# Altium project H19R1.PrjPcb (part 1 of 2)
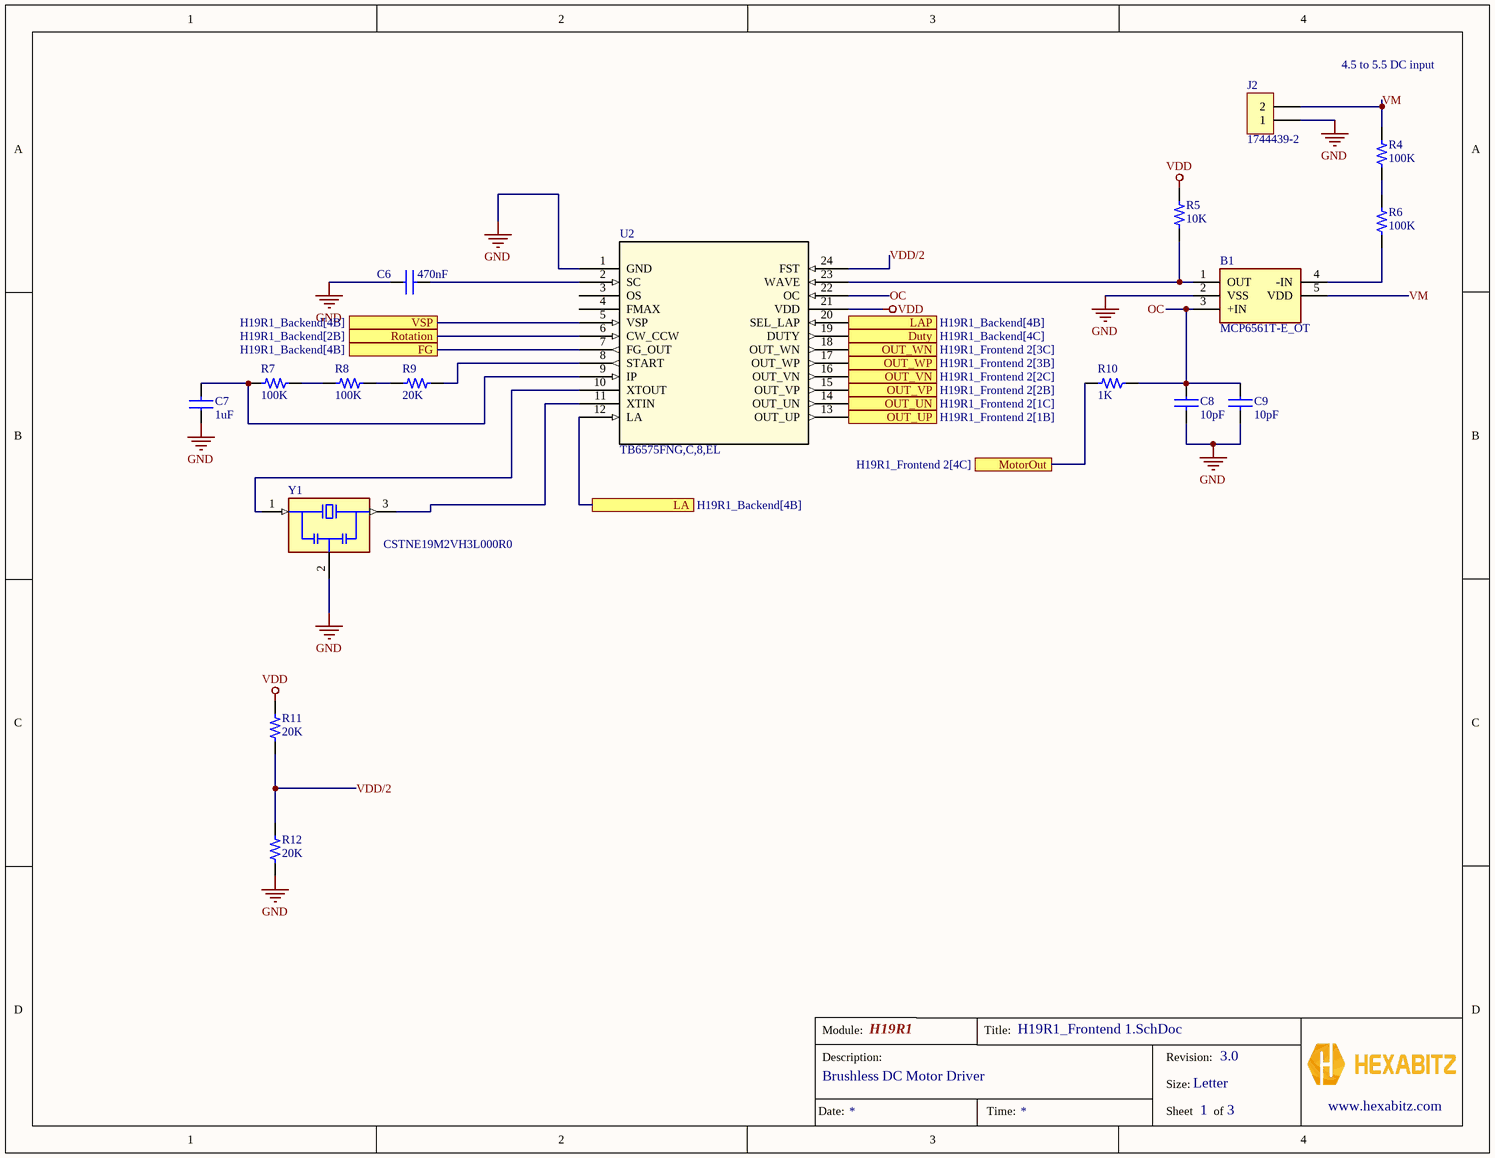
[diagram p0: H19R1_Frontend 1.SchDoc]
revision: 3.0; Module_Name: H19R1; Module_Description: Brushless DC Motor Driver
3 sheets, 80 parts. Net scope: flat (ports and power ports of the same name join across sheets).
Board file: H19R1.PcbDoc
Sheets:
  H19R1_Frontend 1.SchDoc
  H19R1_Frontend 2.SchDoc
  H19R1_Backend.SchDoc

## Sheet H19R1_Frontend 1.SchDoc
size Letter; CompanyName: Hexabitz; DocumentNumber: 1; SheetNumber: 1; SheetTotal: 3

### Parts
B1  MCP6561T-E_OT  [SOT95P270X145-5N]
C6  470nF  [C0402]
C7  value 1uF  [C0402]  (hidden comment: CL05A105KA5NQNC)
C8  value 10pF  [C0402]  (hidden comment: CC0402JRNPO9BN100)
C9  value 10pF  [C0402]  (hidden comment: CC0402JRNPO9BN100)
J2  1744439-2  [17444392]
R4  value 100K  [R0402_3]  (hidden comment: ERJ-2RKF1003X)
R5  value 10K  [R0402_3]  (hidden comment: RC0402FR-0710KL)
R6  value 100K  [R0402_3]  (hidden comment: ERJ-2RKF1003X)
R7  value 100K  [R0402_3]  (hidden comment: ERJ-2RKF1003X)
R8  value 100K  [R0402_3]  (hidden comment: ERJ-2RKF1003X)
R9  value 20K  [R0402_3]  (hidden comment: RMCF0402FT20K0)
R10  value 1K  [R0402_3]  (hidden comment: RC0402FR-071KL)
R11  value 20K  [R0402_3]  (hidden comment: RMCF0402FT20K0)
R12  value 20K  [R0402_3]  (hidden comment: RMCF0402FT20K0)
U2  TB6575FNG,C,8,EL  [SSOP24-P-300-0p65A_TOS]
Y1  CSTNE19M2VH3L000R0  [OSC_CSTNE19M2VH3L000R0]

### Ports
Duty (see H19R1_Backend[4C]), FG (see H19R1_Backend[4B]), LA (see H19R1_Backend[4B]), LAP (see H19R1_Backend[4B]), MotorOut (see H19R1_Frontend 2[4C]), OUT_UN (see H19R1_Frontend 2[1C]), OUT_UP (see H19R1_Frontend 2[1B]), OUT_VN (see H19R1_Frontend 2[2C]), OUT_VP (see H19R1_Frontend 2[2B]), OUT_WN (see H19R1_Frontend 2[3C]), OUT_WP (see H19R1_Frontend 2[3B]), Rotation (see H19R1_Backend[2B]), VSP (see H19R1_Backend[4B])

### Nets
GND: B1.2(VSS) C6.1 C7.1 C8.2 C9.2 J2.1 R12.2 U2.1(GND) Y1.2(GND)
VDD: R5.2 R11.1 U2.21(VDD)
Duty: U2.19(DUTY) ; port Duty
FG: U2.7(FG_OUT) ; port FG
LA: U2.12(LA) ; port LA
LAP: U2.20(SEL_LAP) ; port LAP
MotorOut: R10.1 ; port MotorOut
OC: B1.3(+IN) C8.1 C9.1 R10.2 U2.22(OC)
OUT_UN: U2.14(OUT_UN) ; port OUT_UN
OUT_UP: U2.13(OUT_UP) ; port OUT_UP
OUT_VN: U2.16(OUT_VN) ; port OUT_VN
OUT_VP: U2.15(OUT_VP) ; port OUT_VP
OUT_WN: U2.18(OUT_WN) ; port OUT_WN
OUT_WP: U2.17(OUT_WP) ; port OUT_WP
Rotation: U2.6(CW_CCW) ; port Rotation
VDD/2: R11.2 R12.1 U2.24(FST)
VM: B1.5(VDD) J2.2 R4.2
VSP: U2.5(VSP) ; port VSP
NetB1_1: B1.1(OUT) R5.1 U2.23(WAVE)
NetB1_4: B1.4(-IN) R6.1
NetC6_2: C6.2 U2.2(SC)
NetC7_2: C7.2 R7.1 U2.9(IP)
NetR4_1: R4.1 R6.2
NetR7_2: R7.2 R8.1
NetR8_2: R8.2 R9.2
NetR9_1: R9.1 U2.8(START)
NetU2_10: U2.10(XTOUT) Y1.1(IN)
NetU2_11: U2.11(XTIN) Y1.3(OUT)

Not connected (* = marked no-connect by the designer): U2 3(OS) 4(FMAX)

### Notes on the sheet
- 4.5 to 5.5 DC input
- Module:
- Title:
- Description:
- Size:
- Revision:
- Letter
- www.hexabitz.com
- Date:
- Time:
- Sheet
- of

### Library data of the parts
B1 = MCP6561T-E_OT: Single 1.8V Push/Pull Comparator, E temp; Manufacturer_Name: Microchip; Manufacturer_Part_Number: MCP6561T-E/OT; Geometry.Height: 1.45mm; Avnet Part Number: *; Avnet Price/Stock: *; Datasheet Link: https://datasheet.datasheetarchive.com/originals/distributors/Datasheets-DGA6/571611.pdf; Supplier 1: Newark; Supplier Part Number 1: MCP6561T-E/OT
C6 = C1005X7S1C474K050BC: Multilayer Ceramic Capacitor, 0.47 uF, 16 V, ± 10%, X7S, 0402 [1005 Metric]; Manufacturer: TDK; Material: 4241ConductorMaterial; Voltage Rating: 16V; Dielectric: 1542DielectricType; Library: Hexabitz; Supplier: Digikey; Supplier Part Number: 445-174768-1-ND; Manufacturer Part Number: C1005X7S1C474K050BC; RoHS: Yes; Category: Ceramic Capacitors; Stock: 28339; Pricing: 1=0.2, 10=0.117, 100=0.0734, 1000=0.05087, 2500=0.0442, 5000=0.04189 (USD); Mounting Technology: Surface Mount; Case/Package: 0402; Case Code (Imperial): 0402; Case Code (Metric): 1005; Min Operating Temperature: -55°C; Max Operating Temperature: 125°C; Packaging: Cut Tape; Tolerance: 10%; Series: C; Voltage Rating (DC): 16V; Length: 1mm; Width: 500um; Height: 550um; Thickness: 500um; RoHS Compliant: Yes; Lead Free: 5697LeadFree; ComponentLink1URL: https://product.tdk.com/info/en/catalog/spec/mlccspec_commercial_general_midvoltage_en.pdf?src-supplier=Digikey; ComponentLink1Description: https://product.tdk.com/info/en/catalog/spec/mlccspec_commercial_general_midvoltage_en.pdf?src-supplier=Digikey; ComponentLink2URL: https://product.tdk.com/info/en/catalog/datasheets/mlcc_commercial_general_en.pdf?src-supplier=Digikey; ComponentLink2Description: https://product.tdk.com/info/en/catalog/datasheets/mlcc_commercial_general_en.pdf?src-supplier=Digikey; Supplier 1: Digikey; Supplier Part Number 1: 445-174768-6-ND; Value: 470nF
C7 = CL05A105KA5NQNC: Multilayer Ceramic Capacitor, 1 Uf, 25 V, ½ 10%, X5R, 0402 [1005 Metric]; Manufacturer: Samsung; Voltage Rating: 25V; Library: Hexabitz; Supplier: Digikey; Supplier Part Number: 1276-1445-6-ND; Manufacturer Part Number: CL05A105KA5NQNC; RoHS: Yes; Category: Ceramic Capacitors; Stock: 1206917; Pricing: 1=0.08, 10=0.048, 100=0.0312, 1000=0.0224, 2500=0.02142 (USD); Mounting Technology: Surface Mount; Case/Package: 0402; Material: Ceramic; Case Code (Metric): 1005; Case Code (Imperial): 0402; Min Operating Temperature: -55°C; Max Operating Temperature: 85°C; Package Quantity: 10000; Series: CL; Tolerance: 10%; Packaging: Tape and Reel; Dielectric: X5R; Construction: Flat; Length: 1mm; Width: 0.02inch; Height: 0.5mm; Thickness: 0.022inch; Depth: 0.5mm; Radiation Hardening: No; Lead Free: Lead Free; RoHS Compliant: Yes; ComponentLink1URL: https://datasheet.ciiva.com/25720/cl05a105ka5nqnc-25720771.pdf?src-supplier=Digikey; ComponentLink1Description: https://datasheet.ciiva.com/25720/cl05a105ka5nqnc-25720771.pdf?src-supplier=Digikey; ComponentLink2URL: https://datasheet.ciiva.com/3777/cl05a105ka5nqnc-3777709.pdf?src-supplier=Arrow+Electronics; ComponentLink2Description: https://datasheet.ciiva.com/3777/cl05a105ka5nqnc-3777709.pdf?src-supplier=Arrow+Electronics; ComponentLink3URL: https://datasheet.ciiva.com/29198/459147-da-01-en-vs-kondensator-0402-29198339.pdf?src-supplier=Conrad; ComponentLink3Description: https://datasheet.ciiva.com/29198/459147-da-01-en-vs-kondensator-0402-29198339.pdf?src-supplier=Conrad; Supplier 1: Digikey; Supplier Part Number 1: 1276-1445-6-ND
C8 C9 = CC0402JRNPO9BN100: 0402 10 pF 50 V ±5 % Tolerance NP0 SMT Multilayer Ceramic Capacitor; Manufacturer: Yageo; Library: Hexabitz; Tolerance: 5%; Dielectric: C0G; Voltage Rating: 50V; Temperature Coefficient: 30ppm/°C; Insulation Resistance: 100GR; Supplier: Digikey; Supplier Part Number: 311-1014-6-ND; Manufacturer Part Number: CC0402JRNPO9BN100; RoHS: Yes; Category: Ceramic Capacitors; Stock: 1079299; Pricing: 1=0.1, 10=0.024, 100=0.0133, 1000=0.00812, 2500=0.00685, 5000=0.00609 (USD); Mounting Technology: Surface Mount; Case/Package: 0402; Pins: 2; Case Code (Metric): 1005; Case Code (Imperial): 0402; Dielectric Material: Ceramic; Min Operating Temperature: -55°C; Max Operating Temperature: 125°C; Packaging: Tape and Reel; Voltage Rating (DC): 50V; Package Quantity: 1; Termination: SMD/SMT; Voltage: 50V; Series: CC; Voltage Rating (AC): 50V; Length: 1mm; Width: 0.02inch; Height: 0.5mm; Thickness: 0.022inch; Depth: 0.5mm; Radiation Hardening: No; RoHS Compliant: Yes; Reach SVHC Compliant: No; Lead Free: Lead Free; Halogen Free: 5694HalogenFree; ComponentLink1URL: https://datasheet.ciiva.com/11786/0900766b8079c870-11786158.pdf?src-supplier=Rs; ComponentLink1Description: https://datasheet.ciiva.com/11786/0900766b8079c870-11786158.pdf?src-supplier=Rs; ComponentLink2URL: https://datasheet.ciiva.com/8033/1443161-8033593.pdf?src-supplier=Element14; ComponentLink2Description: https://datasheet.ciiva.com/8033/1443161-8033593.pdf?src-supplier=Element14; ComponentLink3URL: https://datasheet.ciiva.com/28450/1443161-28450213.pdf?src-supplier=Element14; ComponentLink3Description: https://datasheet.ciiva.com/28450/1443161-28450213.pdf?src-supplier=Element14; ComponentLink4URL: https://datasheet.ciiva.com/8033/1443161-8033596.pdf?src-supplier=Element14; ComponentLink4Description: https://datasheet.ciiva.com/8033/1443161-8033596.pdf?src-supplier=Element14; ComponentLink5URL: https://datasheet.ciiva.com/8033/1443161-8033591.pdf?src-supplier=Element14; ComponentLink5Description: https://datasheet.ciiva.com/8033/1443161-8033591.pdf?src-supplier=Element14; ComponentLink6URL: https://datasheet.ciiva.com/143/mlccorderingcode-143993.pdf?src-supplier=Digikey; ComponentLink6Description: https://datasheet.ciiva.com/143/mlccorderingcode-143993.pdf?src-supplier=Digikey; ComponentLink7URL: https://datasheet.ciiva.com/143/mlccorderingcode-143992.pdf?src-supplier=Digikey; ComponentLink7Description: https://datasheet.ciiva.com/143/mlccorderingcode-143992.pdf?src-supplier=Digikey; ComponentLink8URL: https://datasheet.ciiva.com/143/mlccorderingcode-143994.pdf?src-supplier=Digikey; ComponentLink8Description: https://datasheet.ciiva.com/143/mlccorderingcode-143994.pdf?src-supplier=Digikey; ComponentLink9URL: https://datasheet.ciiva.com/5427/upy-gp-np0-16v-to-50v-8-5427741.pdf?src-supplier=Mouser; ComponentLink9Description: https://datasheet.ciiva.com/5427/upy-gp-np0-16v-to-50v-8-5427741.pdf?src-supplier=Mouser; Supplier 1: Digikey; Supplier Part Number 1: 311-1014-6-ND
J2 = 1744439-2: Conn Shrouded Header HDR 2 POS 2.5mm Crimp ST Cable Mount Bag/Box; Manufacturer: TE Connectivity AMP; Library: Hexabitz; Number of Contacts: 2; Gender: Male; Connector Type: Plug,Header,Pin; Wire/Cable Type: Discrete; Backwall/Post Interruptions: No (Without); Connector System: Wire-to-Board; Contact Retention: Yes (With); PCB Mount Retention: With; PCB Mounting Orientation: Vertical; Contact Current Rating: 4.5A; Contact Style: Straight; Plating Thickness: 2.03um; Tail Length: 0.133inch; Wire/Cable Gauge: 18AWG; Supplier: Digikey; Supplier Part Number: A107503-ND; RoHS: Yes; Category: Connectors; Stock: 96; Pricing: 1=0.41, 10=0.347, 100=0.2944, 600=0.25938, 1200=0.247, 5400=0.22212, 10200=0.21237 (USD); Mounting Technology: Through Hole; Contact Plating: Tin,Bright; Contact Material: Copper Alloy; Housing Color: White; Housing Material: Nylon; Contact Shape: Circular; Contact Finish - Mating: TIN; Insulation Material: Nylon; Insulation Color: Natural; Min Operating Temperature: -67°C; Max Operating Temperature: 221°C; Number of Rows: 1; Packaging: Bag; Termination: Kinked Pin; Orientation: Vertical; Mating Alignment: Yes (With); Mating Retention: Yes (With); Number of Positions: 2; PCB Mount Alignment: No (Without); Package Quantity: 600; Strain Relief: No (Without); Fastening Type: Friction; Series: Economy Power 2.5; Contact Type: Male Pin; Length: 7.3mm; Width: 9.58mm; Height: 0.315inch; Pitch: 2.5mm; Radiation Hardening: No; ELV: Compliant; Flammability Rating: UL94 V-0; RoHS Compliant: Yes; ComponentLink1URL: https://www.te.com/commerce/DocumentDelivery/DDEController?Action=srchrtrv&amp;DocNm=1744439&amp;DocType=Customer+Drawing&amp;DocLang=English&src-supplier=Digikey; ComponentLink1Description: https://www.te.com/commerce/DocumentDelivery/DDEController?Action=srchrtrv&amp;DocNm=1744439&amp;DocType=Customer+Drawing&amp;DocLang=English&src-supplier=Digikey; ComponentLink2URL: http://www.te.com/commerce/DocumentDelivery/DDEController?Action=srchrtrv&DocNm=7-1773461-6EP2.5&DocType=Data+Sheet&DocLang=English&src-supplier=Avnet; ComponentLink2Description: http://www.te.com/commerce/DocumentDelivery/DDEController?Action=srchrtrv&DocNm=7-1773461-6EP2.5&DocType=Data+Sheet&DocLang=English&src-supplier=Avnet; Supplier 1: Digikey; Supplier Part Number 1: A107503-ND; Supplier 2: Mouser; Supplier Part Number 2: 571-1744439-2; Manufacturer Part Number: 1744439-2
R4 R6-R8 = ERJ-2RKF1003X: Res Thick Film 0402 100K Ohm 1% 1/10W ±100ppm/°C Molded SMD Punched Carrier T/R; Manufacturer: Panasonic; Power Rating: 100mW; Voltage Rating: 50V; Library: Hexabitz; Supplier: Digikey; Supplier Part Number: P100KLCT-ND; Manufacturer Part Number: ERJ-2RKF1003X; RoHS: Yes; Category: Chip SMD Resistors; Stock: 3425412; Pricing: 1=0.1, 10=0.028, 100=0.0138, 1000=0.00766, 2500=0.00632, 5000=0.00554 (USD); Case Code (Imperial): 0402; Case Code (Metric): 1005; Weight: 0.000388oz; Min Operating Temperature: -55°C; Max Operating Temperature: 155°C; Tolerance: 1%; Packaging: Cut Tape; Package Quantity: 10000; Termination: SMD/SMT; Temperature Coefficient: 100ppm/°C; Series: ERJ-2Rx; Technology: THICK FILM; Voltage Rating (DC): 50V; Length: 1mm; Width: 0.5mm; Height: 0.35mm; RoHS Compliant: Yes; ComponentLink1URL: https://datasheet.ciiva.com/34303/1987038-34303550.pdf?src-supplier=Jameco; ComponentLink1Description: https://datasheet.ciiva.com/34303/1987038-34303550.pdf?src-supplier=Jameco; ComponentLink2URL: https://datasheet.ciiva.com/11821/0900766b80f80784-11821175.pdf?src-supplier=Rs; ComponentLink2Description: https://datasheet.ciiva.com/11821/0900766b80f80784-11821175.pdf?src-supplier=Rs; ComponentLink3URL: https://datasheet.ciiva.com/7830/aoa0000ce2-7830725.pdf?src-supplier=Element14; ComponentLink3Description: https://datasheet.ciiva.com/7830/aoa0000ce2-7830725.pdf?src-supplier=Element14; ComponentLink4URL: https://datasheet.ciiva.com/7830/426256-7830974.pdf?src-supplier=Element14; ComponentLink4Description: https://datasheet.ciiva.com/7830/426256-7830974.pdf?src-supplier=Element14; ComponentLink5URL: https://datasheet.ciiva.com/43467/1678782-43467480.pdf?src-supplier=Farnell; ComponentLink5Description: https://datasheet.ciiva.com/43467/1678782-43467480.pdf?src-supplier=Farnell; ComponentLink6URL: https://datasheet.ciiva.com/22723/426256-22723902.pdf?src-supplier=Element14; ComponentLink6Description: https://datasheet.ciiva.com/22723/426256-22723902.pdf?src-supplier=Element14; ComponentLink7URL: https://datasheet.ciiva.com/16778/70260748-16778055.pdf?src-supplier=Allied+Electronics; ComponentLink7Description: https://datasheet.ciiva.com/16778/70260748-16778055.pdf?src-supplier=Allied+Electronics; ComponentLink8URL: https://datasheet.ciiva.com/16784/70260748-16784190.pdf?src-supplier=Allied+Electronics; ComponentLink8Description: https://datasheet.ciiva.com/16784/70260748-16784190.pdf?src-supplier=Allied+Electronics; Supplier 1: Digikey; Supplier Part Number 1: P100KLDKR-ND
R5 = RC0402FR-0710KL: SMD Chip Resistor, 10 Kohm, ½ 1%, 62.5 Mw, 0402 [1005 Metric], Thick Film, General Purpose; Manufacturer: Yageo; Voltage Rating (DC): 50V; Temperature Coefficient: 100ppm/°C; Power Rating: 62.5mW; Max Power Dissipation: 63mW; Library: Hexabitz; Supplier: Digikey; Supplier Part Number: 311-10.0KLRCT-ND; Manufacturer Part Number: RC0402FR-0710KL; RoHS: Yes; Category: Chip SMD Resistors; Stock: 1034525; Pricing: 1=0.1, 10=0.02, 100=0.009, 1000=0.00474, 2500=0.00381, 5000=0.00328 (USD); Case/Package: 0402; Pins: 2; Case Code (Imperial): 0402; Case Code (Metric): 1005; Min Operating Temperature: -55°C; Max Operating Temperature: 155°C; Resistor Type: Thick Film; Voltage Rating: 50V; Tolerance: 1%; Packaging: Tape and Reel; Termination: SMD/SMT; Series: RC; Number of Terminations: 2; Features: Moisture Resistant; Resistance Tolerance: 1%; Construction: Rectangular; Length: 1mm; Width: 0.5mm; Depth: 0.5mm; Lead Pitch: 0.2mm; RoHS Compliant: Yes; Reach SVHC Compliant: Unknown; Lead Free: 5697LeadFree; Military Standard: Not; ComponentLink1URL: https://datasheet.ciiva.com/7660/38568-7660787.pdf?src-supplier=Element14; ComponentLink1Description: https://datasheet.ciiva.com/7660/38568-7660787.pdf?src-supplier=Element14; ComponentLink2URL: https://datasheet.ciiva.com/7849/1686128-7849814.pdf?src-supplier=Element14; ComponentLink2Description: https://datasheet.ciiva.com/7849/1686128-7849814.pdf?src-supplier=Element14; ComponentLink3URL: https://datasheet.ciiva.com/7983/1018594-7983486.pdf?src-supplier=Element14; ComponentLink3Description: https://datasheet.ciiva.com/7983/1018594-7983486.pdf?src-supplier=Element14; ComponentLink4URL: https://datasheet.ciiva.com/22747/1018594-22747512.pdf?src-supplier=Element14; ComponentLink4Description: https://datasheet.ciiva.com/22747/1018594-22747512.pdf?src-supplier=Element14; ComponentLink5URL: https://datasheet.ciiva.com/12667/pyu-rc0402-51-rohs-l-6-r-12667067.pdf?src-supplier=Mouser; ComponentLink5Description: https://datasheet.ciiva.com/12667/pyu-rc0402-51-rohs-l-6-r-12667067.pdf?src-supplier=Mouser; ComponentLink6URL: https://datasheet.ciiva.com/7849/1784430-7849813.pdf?src-supplier=Element14; ComponentLink6Description: https://datasheet.ciiva.com/7849/1784430-7849813.pdf?src-supplier=Element14; ComponentLink7URL: https://datasheet.ciiva.com/7849/1784430-7849815.pdf?src-supplier=Element14; ComponentLink7Description: https://datasheet.ciiva.com/7849/1784430-7849815.pdf?src-supplier=Element14; Supplier 1: Digikey; Supplier Part Number 1: 311-10.0KLRDKR-ND; Supplier 2: Mouser; Supplier Part Number 2: 603-RC0402FR-0710KL
R9 R11 R12 = RMCF0402FT20K0: Res Thick Film 0402 20K Ohm 1% 0.063W(1/16W) ±100ppm/C Pad SMD Automotive T/R; Manufacturer: Stackpole Electronics; Voltage Rating: 50V; Library: Hexabitz; Supplier: Digikey; Supplier Part Number: RMCF0402FT20K0DKR-ND; Manufacturer Part Number: RMCF0402FT20K0; RoHS: Yes; Category: Chip SMD Resistors; Stock: 1424339; Pricing: 1=0.1, 10=0.019, 100=0.0086, 1000=0.00448, 2500=0.00359, 5000=0.00309 (USD); Lead Free: 5697LeadFree; ComponentLink1URL: http://components.arrow.com/part/dataview/40959032S7284943N1174?src-supplier=Arrow+Electronics; ComponentLink1Description: http://components.arrow.com/part/dataview/40959032S7284943N1174?src-supplier=Arrow+Electronics; ComponentLink2URL: https://www.seielect.com/catalog/SEI-RMCF_RMCP.pdf?src-supplier=Avnet; ComponentLink2Description: https://www.seielect.com/catalog/SEI-RMCF_RMCP.pdf?src-supplier=Avnet; ComponentLink3URL: https://www.seielect.com/catalog/sei-rmcf_rmcp.pdf?src-supplier=Digikey; ComponentLink3Description: https://www.seielect.com/catalog/sei-rmcf_rmcp.pdf?src-supplier=Digikey; ComponentLink4URL: https://datasheet.octopart.com/RMCF0402FT20K0-Stackpole-Electronics-datasheet-154799224.pdf?src-supplier=Master+Electronics; ComponentLink4Description: https://datasheet.octopart.com/RMCF0402FT20K0-Stackpole-Electronics-datasheet-154799224.pdf?src-supplier=Master+Electronics; Supplier 1: Digikey; Supplier Part Number 1: RMCF0402FT20K0DKR-ND
R10 = RC0402FR-071KL: SMD Chip Resistor 1 Kohm ½ 1% 62.5 Mw 0402 [1005 Metric] Thick Film General Purpose; Manufacturer: Yageo; Voltage Rating (DC): 50V; Temperature Coefficient: 100ppm/°C; Power Rating: 62.5mW; Max Power Dissipation: 63mW; Library: Hexabitz; Supplier: Digikey; Supplier Part Number: 311-1.00KLRDKR-ND; Manufacturer Part Number: RC0402FR-071KL; RoHS: Yes; Category: Chip SMD Resistors; Stock: 2438980; Pricing: 1=0.1, 10=0.007, 100=0.0061, 1000=0.0051, 2500=0.00408 (USD); Case/Package: 0402; Pins: 2; Case Code (Imperial): 0402; Case Code (Metric): 1005; Min Operating Temperature: -55°C; Max Operating Temperature: 155°C; Tolerance: 1%; Packaging: Tape and Reel; Resistor Type: Thick Film; Voltage Rating: 50V; Termination: SMD/SMT; Features: Moisture Resistant; Series: RC; Number of Terminations: 2; Resistance Tolerance: 1%; Construction: Rectangular; Technology: THICK FILM; Voltage Rating (AC): 50V; Length: 1mm; Width: 0.5mm; Height: 0.32mm; Depth: 0.5mm; Reach SVHC Compliant: No; Lead Free: 5697LeadFree; Military Standard: Not; RoHS Compliant: Yes; ComponentLink1URL: https://datasheet.ciiva.com/11819/0900766b80c66297-11819477.pdf?src-supplier=Rs; ComponentLink1Description: https://datasheet.ciiva.com/11819/0900766b80c66297-11819477.pdf?src-supplier=Rs; ComponentLink2URL: https://datasheet.ciiva.com/7983/1018594-7983502.pdf?src-supplier=Element14; ComponentLink2Description: https://datasheet.ciiva.com/7983/1018594-7983502.pdf?src-supplier=Element14; ComponentLink3URL: https://datasheet.ciiva.com/22747/1018594-22747513.pdf?src-supplier=Element14; ComponentLink3Description: https://datasheet.ciiva.com/22747/1018594-22747513.pdf?src-supplier=Element14; ComponentLink4URL: https://datasheet.ciiva.com/12666/pyu-rc0402-51-rohs-l-6-r-12666741.pdf?src-supplier=Mouser; ComponentLink4Description: https://datasheet.ciiva.com/12666/pyu-rc0402-51-rohs-l-6-r-12666741.pdf?src-supplier=Mouser; ComponentLink5URL: https://datasheet.ciiva.com/7849/1018594-7849869.pdf?src-supplier=Element14; ComponentLink5Description: https://datasheet.ciiva.com/7849/1018594-7849869.pdf?src-supplier=Element14; ComponentLink6URL: https://datasheet.ciiva.com/7849/1018594-7849871.pdf?src-supplier=Element14; ComponentLink6Description: https://datasheet.ciiva.com/7849/1018594-7849871.pdf?src-supplier=Element14; ComponentLink7URL: https://datasheet.ciiva.com/17063/pyu-rc0402-51-rohs-l-6-r-17063193.pdf?src-supplier=Future+Electronics; ComponentLink7Description: https://datasheet.ciiva.com/17063/pyu-rc0402-51-rohs-l-6-r-17063193.pdf?src-supplier=Future+Electronics; Supplier 1: Digikey; Supplier Part Number 1: 311-1.00KLRDKR-ND
U2 = TB6575FNG,C,8,EL: No Description Available; Manufacturer_Name: Toshiba Electronic Devices & Storage Corp.; Copyright: Copyright (C) 2025 Ultra Librarian. All rights reserved.; Manufacturer_Part_Number: TB6575FNG,C,8,EL; RefDes: RefDes; Type: Type; Supplier 1: Newark; Supplier Part Number 1: TB6575FNG(O,C,8,EL
Y1 = CSTNE19M2VH3L000R0: 19.2MHz Ceramic Resonator Built in Capacitor 15pF Â±0.11% -40Â°C ~ 85Â°C Surface Mount; MF: Murata Electronics; Digi-Key_Part_Number: 490-18268-2-ND; Purchase-URL: https://pricing.snapeda.com/search/part/CSTNE19M2VH3L000R0/?ref=eda; Check_prices: https://www.snapeda.com/parts/CSTNE19M2VH3L000R0/Murata/view-part/?ref=eda; MP: CSTNE19M2VH3L000R0; Value: *; SnapEDA_Link: https://www.snapeda.com/parts/CSTNE19M2VH3L000R0/Murata/view-part/?ref=snap; Package: SMD-3 Murata; Supplier 1: Arrow Electronics; Supplier Part Number 1: CSTNE19M2VH3L000R0

## Sheet H19R1_Frontend 2.SchDoc
size Letter; CompanyName: Hexabitz; DocumentNumber: 2; SheetNumber: 2; SheetTotal: 3
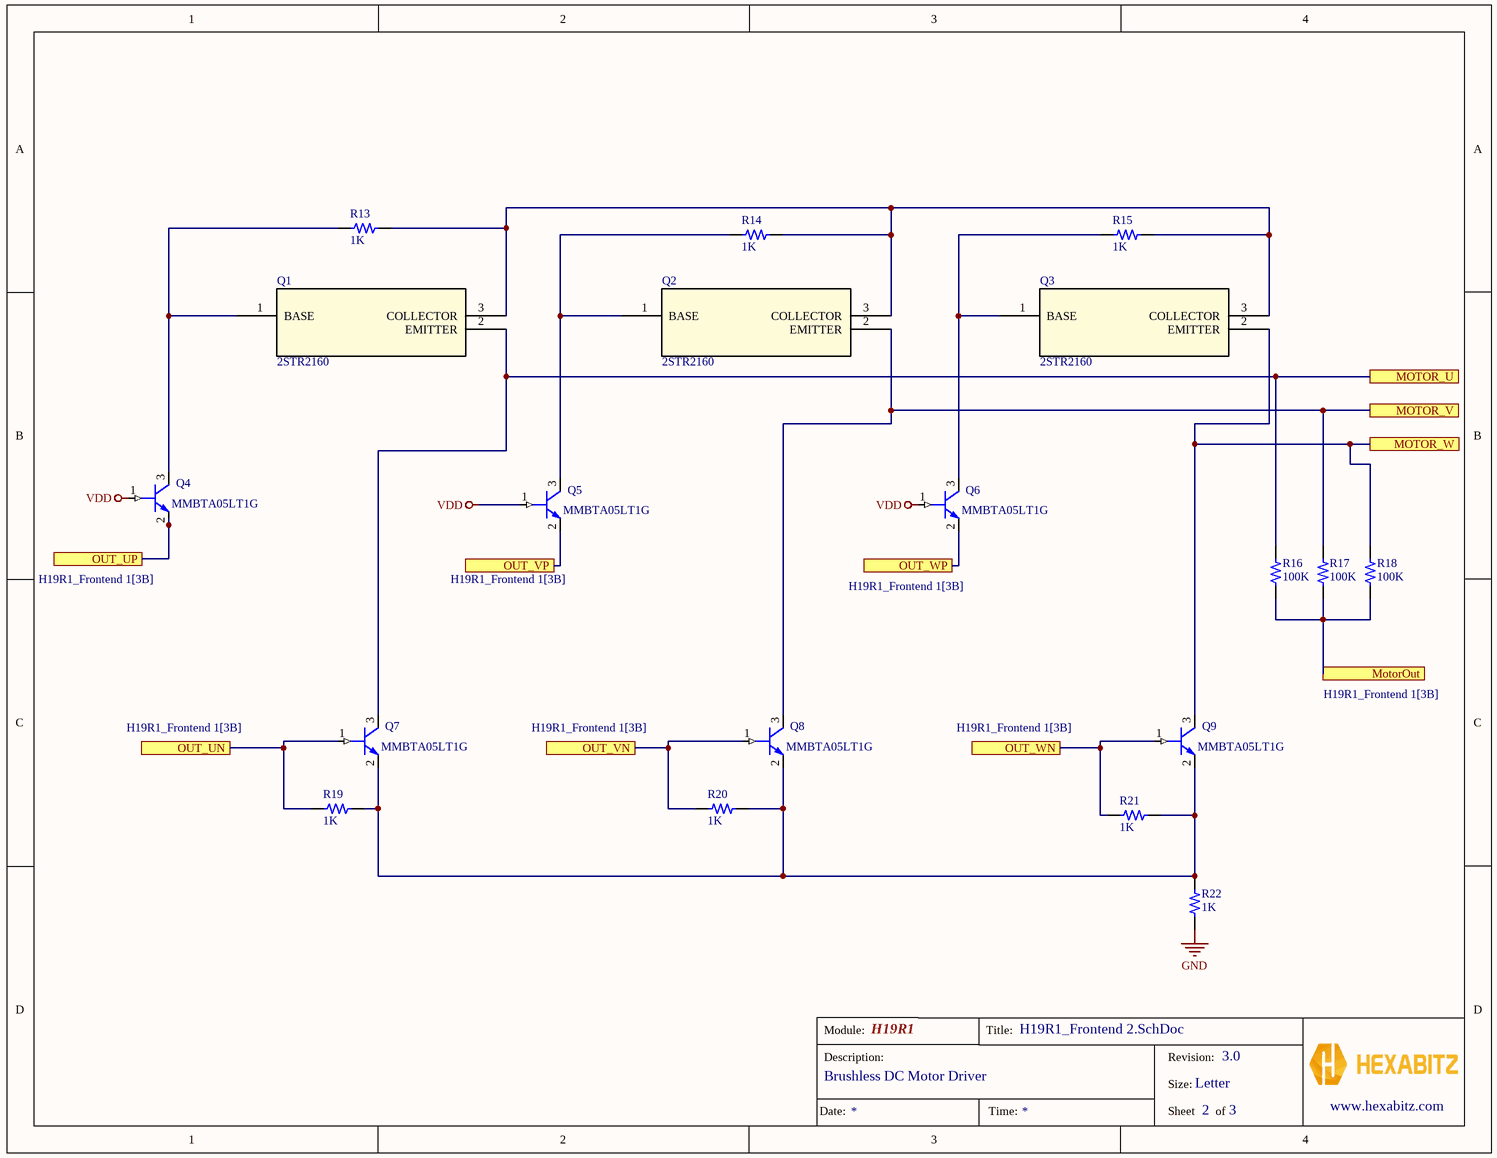
[diagram p1: H19R1_Frontend 2.SchDoc]

### Parts
Q1  2STR2160  [SOT23_3P04X1P75X1P9_STM]
Q2  2STR2160  [SOT23_3P04X1P75X1P9_STM]
Q3  2STR2160  [SOT23_3P04X1P75X1P9_STM]
Q4  MMBTA05LT1G  [SOT-23]
Q5  MMBTA05LT1G  [SOT-23]
Q6  MMBTA05LT1G  [SOT-23]
Q7  MMBTA05LT1G  [SOT-23]
Q8  MMBTA05LT1G  [SOT-23]
Q9  MMBTA05LT1G  [SOT-23]
R13  value 1K  [R0402_3]  (hidden comment: RC0402FR-071KL)
R14  value 1K  [R0402_3]  (hidden comment: RC0402FR-071KL)
R15  value 1K  [R0402_3]  (hidden comment: RC0402FR-071KL)
R16  value 100K  [R0402_3]  (hidden comment: ERJ-2RKF1003X)
R17  value 100K  [R0402_3]  (hidden comment: ERJ-2RKF1003X)
R18  value 100K  [R0402_3]  (hidden comment: ERJ-2RKF1003X)
R19  value 1K  [R0402_3]  (hidden comment: RC0402FR-071KL)
R20  value 1K  [R0402_3]  (hidden comment: RC0402FR-071KL)
R21  value 1K  [R0402_3]  (hidden comment: RC0402FR-071KL)
R22  value 1K  [R0402_3]  (hidden comment: RC0402FR-071KL)

### Ports
MOTOR_U, MOTOR_V, MOTOR_W, MotorOut (see H19R1_Frontend 1[3B]), OUT_UN (see H19R1_Frontend 1[3B]), OUT_UP (see H19R1_Frontend 1[3B]), OUT_VN (see H19R1_Frontend 1[3B]), OUT_VP (see H19R1_Frontend 1[3B]), OUT_WN (see H19R1_Frontend 1[3B]), OUT_WP (see H19R1_Frontend 1[3B])

### Nets
GND: R22.1
VDD: Q4.1(BASE) Q5.1(BASE) Q6.1(BASE)
MOTOR_U: Q1.2(EMITTER) Q7.3(COLLECTOR) R16.2 ; port MOTOR_U
MOTOR_V: Q2.2(EMITTER) Q8.3(COLLECTOR) R17.2 ; port MOTOR_V
MOTOR_W: Q3.2(EMITTER) Q9.3(COLLECTOR) R18.2 ; port MOTOR_W
MotorOut: R16.1 R17.1 R18.1 ; port MotorOut
OUT_UN: Q7.1(BASE) R19.1 ; port OUT_UN
OUT_UP: Q4.2(EMITTER) ; port OUT_UP
OUT_VN: Q8.1(BASE) R20.1 ; port OUT_VN
OUT_VP: Q5.2(EMITTER) ; port OUT_VP
OUT_WN: Q9.1(BASE) R21.1 ; port OUT_WN
OUT_WP: Q6.2(EMITTER) ; port OUT_WP
NetQ1_1: Q1.1(BASE) Q4.3(COLLECTOR) R13.1
NetQ1_3: Q1.3(COLLECTOR) Q2.3(COLLECTOR) Q3.3(COLLECTOR) R13.2 R14.2 R15.2
NetQ2_1: Q2.1(BASE) Q5.3(COLLECTOR) R14.1
NetQ3_1: Q3.1(BASE) Q6.3(COLLECTOR) R15.1
NetQ7_2: Q7.2(EMITTER) Q8.2(EMITTER) Q9.2(EMITTER) R19.2 R20.2 R21.2 R22.2

### Notes on the sheet
- Module:
- Title:
- Description:
- Size:
- Revision:
- Letter
- www.hexabitz.com
- Date:
- Time:
- Sheet
- of

### Library data of the parts
Q1-Q3 = 2STR2160: Low voltage fast-switching PNP power transistor; Manufacturer_Name: STMicroelectronics; Copyright: Copyright (C) 2025 Ultra Librarian. All rights reserved.; Manufacturer_Part_Number: 2STR2160; Datasheet: https://www.st.com/resource/en/datasheet/2str2160.pdf; RefDes: RefDes; Type: Type
  Q1: Supplier 1: Avnet; Supplier Part Number 1: 45AC8085
Q4-Q9 = MMBTA05LT1G: ON Semi MMBTA05LT1G NPN Bipolar Transistor; 0.5 A; 60 V; 3-Pin SOT-23; Manufacturer: ON Semiconductor; Library: Hexabitz; Supplier: Digikey; Supplier Part Number: MMBTA05LT1GOSDKR-ND; RoHS: Yes; Category: BJTs; Stock: 21706; Pricing: 1=0.19, 10=0.113, 100=0.07, 500=0.05098, 1000=0.0448 (USD); ComponentLink1URL: https://datasheet.ciiva.com/976/mmbta05lt1-d-976497.pdf?src-supplier=Digikey; ComponentLink1Description: https://datasheet.ciiva.com/976/mmbta05lt1-d-976497.pdf?src-supplier=Digikey; ComponentLink2URL: https://datasheet.ciiva.com/976/mmbta05lt1-d-976498.pdf?src-supplier=Digikey; ComponentLink2Description: https://datasheet.ciiva.com/976/mmbta05lt1-d-976498.pdf?src-supplier=Digikey; ComponentLink3URL: https://datasheet.ciiva.com/976/mmbta05lt1-d-976499.pdf?src-supplier=Digikey; ComponentLink3Description: https://datasheet.ciiva.com/976/mmbta05lt1-d-976499.pdf?src-supplier=Digikey; ComponentLink4URL: https://datasheet.ciiva.com/11204/mmbta05lt1-d-11204053.pdf?src-supplier=Avnet; ComponentLink4Description: https://datasheet.ciiva.com/11204/mmbta05lt1-d-11204053.pdf?src-supplier=Avnet; ComponentLink5URL: https://datasheet.ciiva.com/16507/mmbta05lt1-d-16507334.pdf?src-supplier=Future+Electronics; ComponentLink5Description: https://datasheet.ciiva.com/16507/mmbta05lt1-d-16507334.pdf?src-supplier=Future+Electronics; Supplier 1: Digikey; Supplier Part Number 1: MMBTA05LT1GOSDKR-ND; Manufacturer Part Number: MMBTA05LT1G
R13-R15 R19-R22 = RC0402FR-071KL: as R10 on sheet H19R1_Frontend 1; Supplier: Digikey; Supplier Part Number: 311-1.00KLRDKR-ND; Manufacturer Part Number: RC0402FR-071KL; RoHS: Yes; Category: Chip SMD Resistors; Stock: 2438980; Pricing: 1=0.1, 10=0.007, 100=0.0061, 1000=0.0051, 2500=0.00408 (USD); Case/Package: 0402; Pins: 2; Case Code (Imperial): 0402; Case Code (Metric): 1005; Min Operating Temperature: -55°C; Max Operating Temperature: 155°C; Tolerance: 1%; Packaging: Tape and Reel; Resistor Type: Thick Film; Voltage Rating: 50V; Termination: SMD/SMT; Features: Moisture Resistant; Series: RC; Number of Terminations: 2; Resistance Tolerance: 1%; Construction: Rectangular; Technology: THICK FILM; Voltage Rating (AC): 50V; Length: 1mm; Width: 0.5mm; Height: 0.32mm; Depth: 0.5mm; Reach SVHC Compliant: No; Lead Free: 5697LeadFree; Military Standard: Not; RoHS Compliant: Yes; ComponentLink1URL: https://datasheet.ciiva.com/11819/0900766b80c66297-11819477.pdf?src-supplier=Rs; ComponentLink1Description: https://datasheet.ciiva.com/11819/0900766b80c66297-11819477.pdf?src-supplier=Rs; ComponentLink2URL: https://datasheet.ciiva.com/7983/1018594-7983502.pdf?src-supplier=Element14; ComponentLink2Description: https://datasheet.ciiva.com/7983/1018594-7983502.pdf?src-supplier=Element14; ComponentLink3URL: https://datasheet.ciiva.com/22747/1018594-22747513.pdf?src-supplier=Element14; ComponentLink3Description: https://datasheet.ciiva.com/22747/1018594-22747513.pdf?src-supplier=Element14; ComponentLink4URL: https://datasheet.ciiva.com/12666/pyu-rc0402-51-rohs-l-6-r-12666741.pdf?src-supplier=Mouser; ComponentLink4Description: https://datasheet.ciiva.com/12666/pyu-rc0402-51-rohs-l-6-r-12666741.pdf?src-supplier=Mouser; ComponentLink5URL: https://datasheet.ciiva.com/7849/1018594-7849869.pdf?src-supplier=Element14; ComponentLink5Description: https://datasheet.ciiva.com/7849/1018594-7849869.pdf?src-supplier=Element14; ComponentLink6URL: https://datasheet.ciiva.com/7849/1018594-7849871.pdf?src-supplier=Element14; ComponentLink6Description: https://datasheet.ciiva.com/7849/1018594-7849871.pdf?src-supplier=Element14; ComponentLink7URL: https://datasheet.ciiva.com/17063/pyu-rc0402-51-rohs-l-6-r-17063193.pdf?src-supplier=Future+Electronics; ComponentLink7Description: https://datasheet.ciiva.com/17063/pyu-rc0402-51-rohs-l-6-r-17063193.pdf?src-supplier=Future+Electronics; Supplier 1: Digikey; Supplier Part Number 1: 311-1.00KLRDKR-ND
R16-R18 = ERJ-2RKF1003X: as R4 on sheet H19R1_Frontend 1; Supplier: Digikey; Supplier Part Number: P100KLCT-ND; Manufacturer Part Number: ERJ-2RKF1003X; RoHS: Yes; Category: Chip SMD Resistors; Stock: 3425412; Pricing: 1=0.1, 10=0.028, 100=0.0138, 1000=0.00766, 2500=0.00632, 5000=0.00554 (USD); Case Code (Imperial): 0402; Case Code (Metric): 1005; Weight: 0.000388oz; Min Operating Temperature: -55°C; Max Operating Temperature: 155°C; Tolerance: 1%; Packaging: Cut Tape; Package Quantity: 10000; Termination: SMD/SMT; Temperature Coefficient: 100ppm/°C; Series: ERJ-2Rx; Technology: THICK FILM; Voltage Rating (DC): 50V; Length: 1mm; Width: 0.5mm; Height: 0.35mm; RoHS Compliant: Yes; ComponentLink1URL: https://datasheet.ciiva.com/34303/1987038-34303550.pdf?src-supplier=Jameco; ComponentLink1Description: https://datasheet.ciiva.com/34303/1987038-34303550.pdf?src-supplier=Jameco; ComponentLink2URL: https://datasheet.ciiva.com/11821/0900766b80f80784-11821175.pdf?src-supplier=Rs; ComponentLink2Description: https://datasheet.ciiva.com/11821/0900766b80f80784-11821175.pdf?src-supplier=Rs; ComponentLink3URL: https://datasheet.ciiva.com/7830/aoa0000ce2-7830725.pdf?src-supplier=Element14; ComponentLink3Description: https://datasheet.ciiva.com/7830/aoa0000ce2-7830725.pdf?src-supplier=Element14; ComponentLink4URL: https://datasheet.ciiva.com/7830/426256-7830974.pdf?src-supplier=Element14; ComponentLink4Description: https://datasheet.ciiva.com/7830/426256-7830974.pdf?src-supplier=Element14; ComponentLink5URL: https://datasheet.ciiva.com/43467/1678782-43467480.pdf?src-supplier=Farnell; ComponentLink5Description: https://datasheet.ciiva.com/43467/1678782-43467480.pdf?src-supplier=Farnell; ComponentLink6URL: https://datasheet.ciiva.com/22723/426256-22723902.pdf?src-supplier=Element14; ComponentLink6Description: https://datasheet.ciiva.com/22723/426256-22723902.pdf?src-supplier=Element14; ComponentLink7URL: https://datasheet.ciiva.com/16778/70260748-16778055.pdf?src-supplier=Allied+Electronics; ComponentLink7Description: https://datasheet.ciiva.com/16778/70260748-16778055.pdf?src-supplier=Allied+Electronics; ComponentLink8URL: https://datasheet.ciiva.com/16784/70260748-16784190.pdf?src-supplier=Allied+Electronics; ComponentLink8Description: https://datasheet.ciiva.com/16784/70260748-16784190.pdf?src-supplier=Allied+Electronics; Supplier 1: Digikey; Supplier Part Number 1: P100KLDKR-ND